# EAGLE design Rolllaeden (EAGLE 7.4.0)

## Sheet 1 of 3
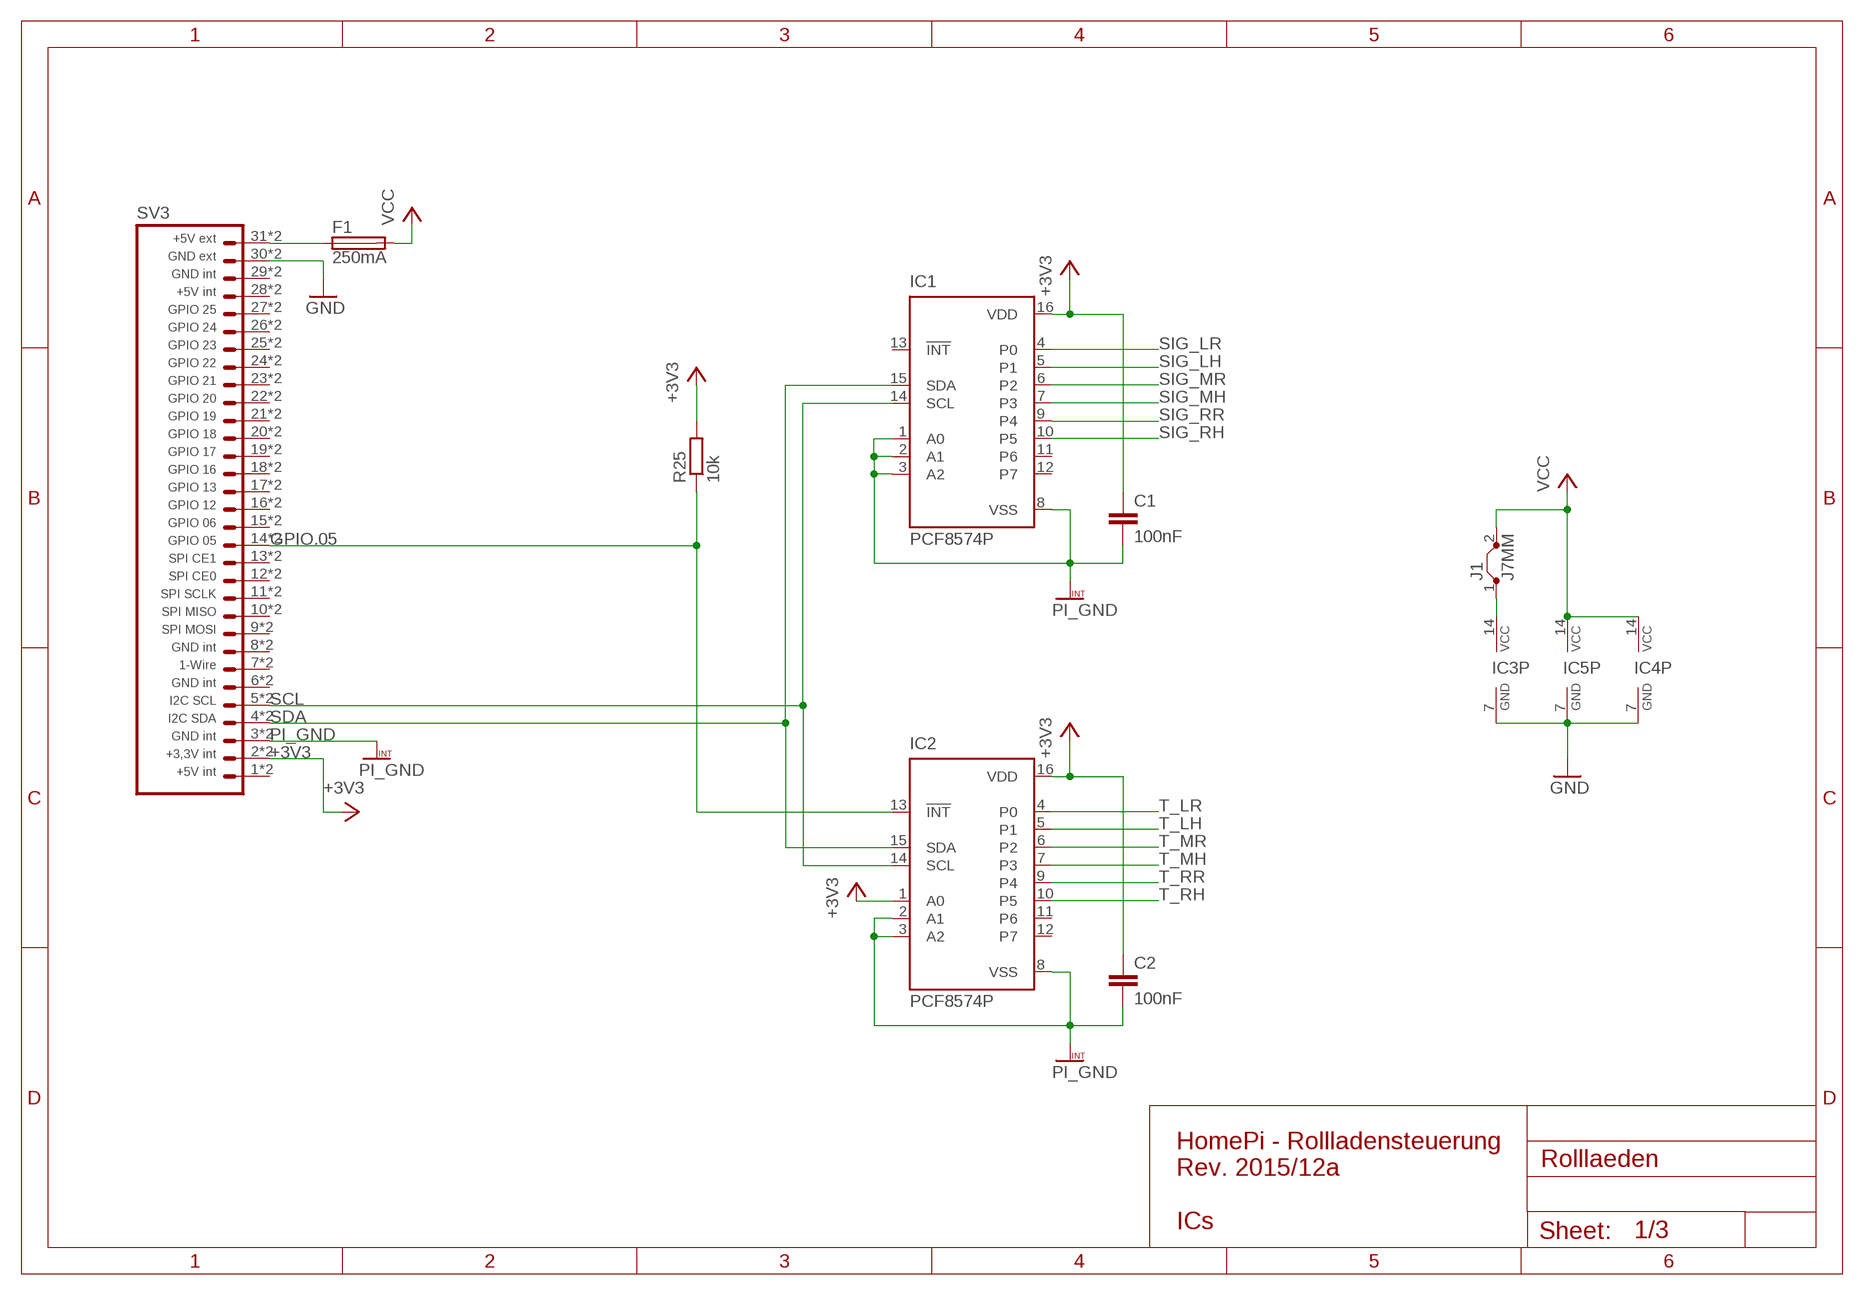
[diagram p0: schematic, sheet 1]

### Parts
C1  100nF  C-EU025-025X050  [C025-025X050]
C2  100nF  C-EU025-025X050  [C025-025X050]
F1  250mA  LITTLEFUSE  [LITTLEFUSE]
IC1  PCF8574P  [DIL16]
IC2  PCF8574P  [DIL16]
IC3  74HCT04N  [DIL14]
IC4  74HCT08N  [DIL14]
IC5  74HCT08N  [DIL14]
J1  J7MM  [07]
R25  10k  R-EU_0204/2V  [0204V]
SV3  PLATINENVERBINDER-31SMD  [PLATINENVERBINDER-31-SMD]

### Nets
+3V3: C1.1 C2.1 IC1.16(VDD) IC2.1(A0) IC2.16(VDD) R25.2 SV3.2 SV3.2T ; also sheet 2
GND [gnd]: IC3.7(P:GND) IC4.7(P:GND) IC5.7(P:GND) SV3.30 SV3.30T ; also sheet 2,3
GPIO.05: IC2.13(!INT) R25.1 SV3.14 SV3.14T
N$67: IC3.14(P:VCC) J1.1
N$68: F1.1 SV3.31 SV3.31T
PI_GND [gnd]: C1.2 C2.2 IC1.1(A0) IC1.2(A1) IC1.3(A2) IC1.8(VSS) IC2.2(A1) IC2.3(A2) IC2.8(VSS) SV3.3 SV3.3T ; also sheet 3
SCL: IC1.14(SCL) IC2.14(SCL) SV3.5 SV3.5T
SDA: IC1.15(SDA) IC2.15(SDA) SV3.4 SV3.4T
SIG_LH: IC1.5(P1) ; also sheet 2
SIG_LR: IC1.4(P0) ; also sheet 2
SIG_MH: IC1.7(P3) ; also sheet 2
SIG_MR: IC1.6(P2) ; also sheet 2
SIG_RH: IC1.10(P5) ; also sheet 2
SIG_RR: IC1.9(P4) ; also sheet 2
T_LH: IC2.5(P1) ; also sheet 3
T_LR: IC2.4(P0) ; also sheet 3
T_MH: IC2.7(P3) ; also sheet 3
T_MR: IC2.6(P2) ; also sheet 3
T_RH: IC2.10(P5) ; also sheet 3
T_RR: IC2.9(P4) ; also sheet 3
VCC: F1.2 IC4.14(P:VCC) IC5.14(P:VCC) J1.2 ; also sheet 2,3
Unconnected: IC1.11(P6) IC1.12(P7) IC1.13(!INT) IC2.11(P6) IC2.12(P7) IC4.1(A:I0) IC4.2(A:I1) IC4.3(A:O) IC4.4(B:I0) IC4.5(B:I1) IC4.6(B:O) SV3.1 SV3.1T SV3.6 SV3.6T SV3.7 SV3.7T SV3.8 SV3.8T SV3.9 SV3.9T SV3.10 SV3.10T SV3.11 SV3.11T SV3.12 SV3.12T SV3.13 SV3.13T SV3.15 SV3.15T SV3.16 SV3.16T SV3.17 SV3.17T SV3.18 SV3.18T SV3.19 SV3.19T SV3.20 SV3.20T SV3.21 SV3.21T SV3.22 SV3.22T SV3.23 SV3.23T SV3.24 SV3.24T SV3.25 SV3.25T SV3.26 SV3.26T SV3.27 SV3.27T SV3.28 SV3.28T SV3.29 SV3.29T

### Notes on the sheet
- HomePi - Rollladensteuerung
  Rev. 2015/12a
  
  ICs

## Sheet 2 of 3
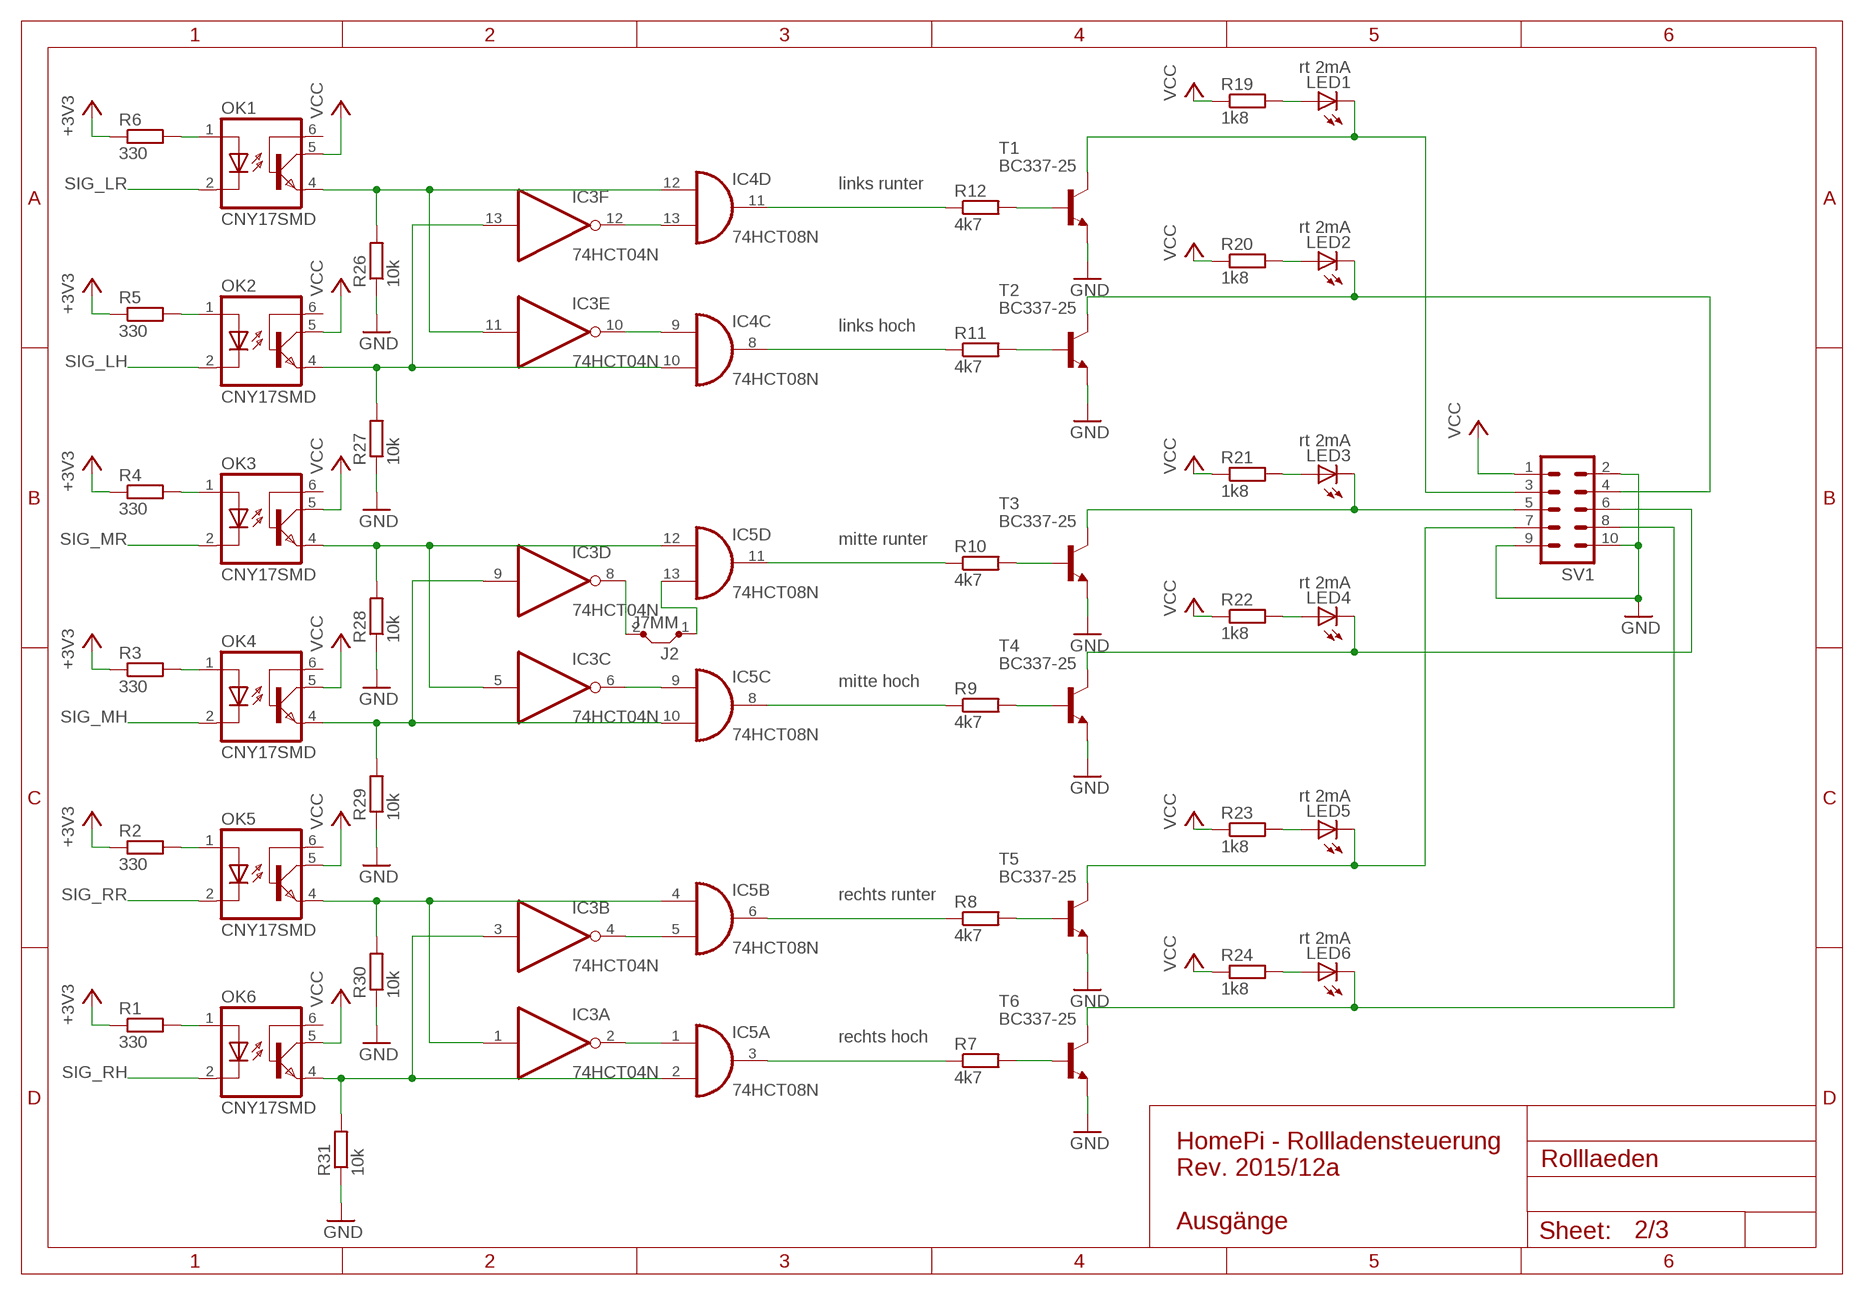
[diagram p1: schematic, sheet 2]

### Parts
J2  J7MM  [07]
LED1  rt 2mA  LED3MM  [LED3MM]
LED2  rt 2mA  LED3MM  [LED3MM]
LED3  rt 2mA  LED3MM  [LED3MM]
LED4  rt 2mA  LED3MM  [LED3MM]
LED5  rt 2mA  LED3MM  [LED3MM]
LED6  rt 2mA  LED3MM  [LED3MM]
OK1  CNY17SMD  [DIL06_SMD]
OK2  CNY17SMD  [DIL06_SMD]
OK3  CNY17SMD  [DIL06_SMD]
OK4  CNY17SMD  [DIL06_SMD]
OK5  CNY17SMD  [DIL06_SMD]
OK6  CNY17SMD  [DIL06_SMD]
R1  330  R-EU_0204/2V  [0204V]
R2  330  R-EU_0204/2V  [0204V]
R3  330  R-EU_0204/2V  [0204V]
R4  330  R-EU_0204/2V  [0204V]
R5  330  R-EU_0204/2V  [0204V]
R6  330  R-EU_0204/2V  [0204V]
R7  4k7  R-EU_0204/2V  [0204V]
R8  4k7  R-EU_0204/2V  [0204V]
R9  4k7  R-EU_0204/2V  [0204V]
R10  4k7  R-EU_0204/2V  [0204V]
R11  4k7  R-EU_0204/2V  [0204V]
R12  4k7  R-EU_0204/2V  [0204V]
R19  1k8  R-EU_0204/2V  [0204V]
R20  1k8  R-EU_0204/2V  [0204V]
R21  1k8  R-EU_0204/2V  [0204V]
R22  1k8  R-EU_0204/2V  [0204V]
R23  1k8  R-EU_0204/2V  [0204V]
R24  1k8  R-EU_0204/2V  [0204V]
R26  10k  R-EU_0204/2V  [0204V]
R27  10k  R-EU_0204/2V  [0204V]
R28  10k  R-EU_0204/2V  [0204V]
R29  10k  R-EU_0204/2V  [0204V]
R30  10k  R-EU_0204/2V  [0204V]
R31  10k  R-EU_0204/2V  [0204V]
SV1  ML10  [ML10]
T1  BC337-25  BC337-25-NPN-TO92-CBE  [TO92-CBE]
T2  BC337-25  BC337-25-NPN-TO92-CBE  [TO92-CBE]
T3  BC337-25  BC337-25-NPN-TO92-CBE  [TO92-CBE]
T4  BC337-25  BC337-25-NPN-TO92-CBE  [TO92-CBE]
T5  BC337-25  BC337-25-NPN-TO92-CBE  [TO92-CBE]
T6  BC337-25  BC337-25-NPN-TO92-CBE  [TO92-CBE]

### Nets
+3V3: R1.1 R2.1 R3.1 R4.1 R5.1 R6.1 ; also sheet 1
GND [gnd]: R26.1 R27.1 R28.1 R29.1 R30.1 R31.1 SV1.2 SV1.9 SV1.10 T1.E T2.E T3.E T4.E T5.E T6.E ; also sheet 1,3
N$1: OK5.1(A) R2.2
N$2: OK6.1(A) R1.2
N$3: R9.2 T4.B
N$4: IC3.3(B:I) IC5.2(A:I1) OK6.4(EMI) R31.2
N$6: IC5.3(A:O) R7.1
N$7: IC3.4(B:O) IC5.5(B:I1)
N$8: R10.2 T3.B
N$9: R8.2 T5.B
N$10: IC3.2(A:O) IC5.1(A:I0)
N$11: IC3.1(A:I) IC5.4(B:I0) OK5.4(EMI) R30.2
N$12: IC5.6(B:O) R8.1
N$13: OK2.1(A) R5.2
N$14: OK1.1(A) R6.2
N$15: LED1.A R19.2
N$17: OK4.1(A) R3.2
N$18: OK3.1(A) R4.2
N$22: IC3.9(D:I) IC5.10(C:I1) OK4.4(EMI) R29.2
N$23: IC3.5(C:I) IC5.12(D:I0) OK3.4(EMI) R28.2
N$24: IC3.8(D:O) J2.2
N$25: IC3.6(C:O) IC5.9(C:I0)
N$26: R7.2 T6.B
N$27: R11.2 T2.B
N$28: R12.2 T1.B
N$29: LED1.K(C) SV1.3 T1.C
N$30: IC5.8(C:O) R9.1
N$31: IC5.11(D:O) R10.1
N$34: IC3.13(F:I) IC4.10(C:I1) OK2.4(EMI) R27.2
N$35: IC3.11(E:I) IC4.12(D:I0) OK1.4(EMI) R26.2
N$38: IC3.12(F:O) IC4.13(D:I1)
N$39: IC3.10(E:O) IC4.9(C:I0)
N$40: LED2.K(C) SV1.4 T2.C
N$41: LED3.K(C) SV1.5 T3.C
N$42: LED4.K(C) SV1.6 T4.C
N$43: LED5.K(C) SV1.7 T5.C
N$44: IC4.8(C:O) R11.1
N$45: IC4.11(D:O) R12.1
N$46: LED6.K(C) SV1.8 T6.C
N$61: LED2.A R20.2
N$62: LED3.A R21.2
N$63: LED4.A R22.2
N$64: LED5.A R23.2
N$65: LED6.A R24.2
N$66: IC5.13(D:I1) J2.1
SIG_LH: OK2.2(C) ; also sheet 1
SIG_LR: OK1.2(C) ; also sheet 1
SIG_MH: OK4.2(C) ; also sheet 1
SIG_MR: OK3.2(C) ; also sheet 1
SIG_RH: OK6.2(C) ; also sheet 1
SIG_RR: OK5.2(C) ; also sheet 1
VCC: OK1.5(COL) OK2.5(COL) OK3.5(COL) OK4.5(COL) OK5.5(COL) OK6.5(COL) R19.1 R20.1 R21.1 R22.1 R23.1 R24.1 SV1.1 ; also sheet 1,3
Unconnected: OK1.6(BAS) OK2.6(BAS) OK3.6(BAS) OK4.6(BAS) OK5.6(BAS) OK6.6(BAS)

### Notes on the sheet
- links runter
- links hoch
- mitte runter
- mitte hoch
- rechts runter
- rechts hoch
- HomePi - Rollladensteuerung
  Rev. 2015/12a
  
  Ausgänge

## Sheet 3 of 3
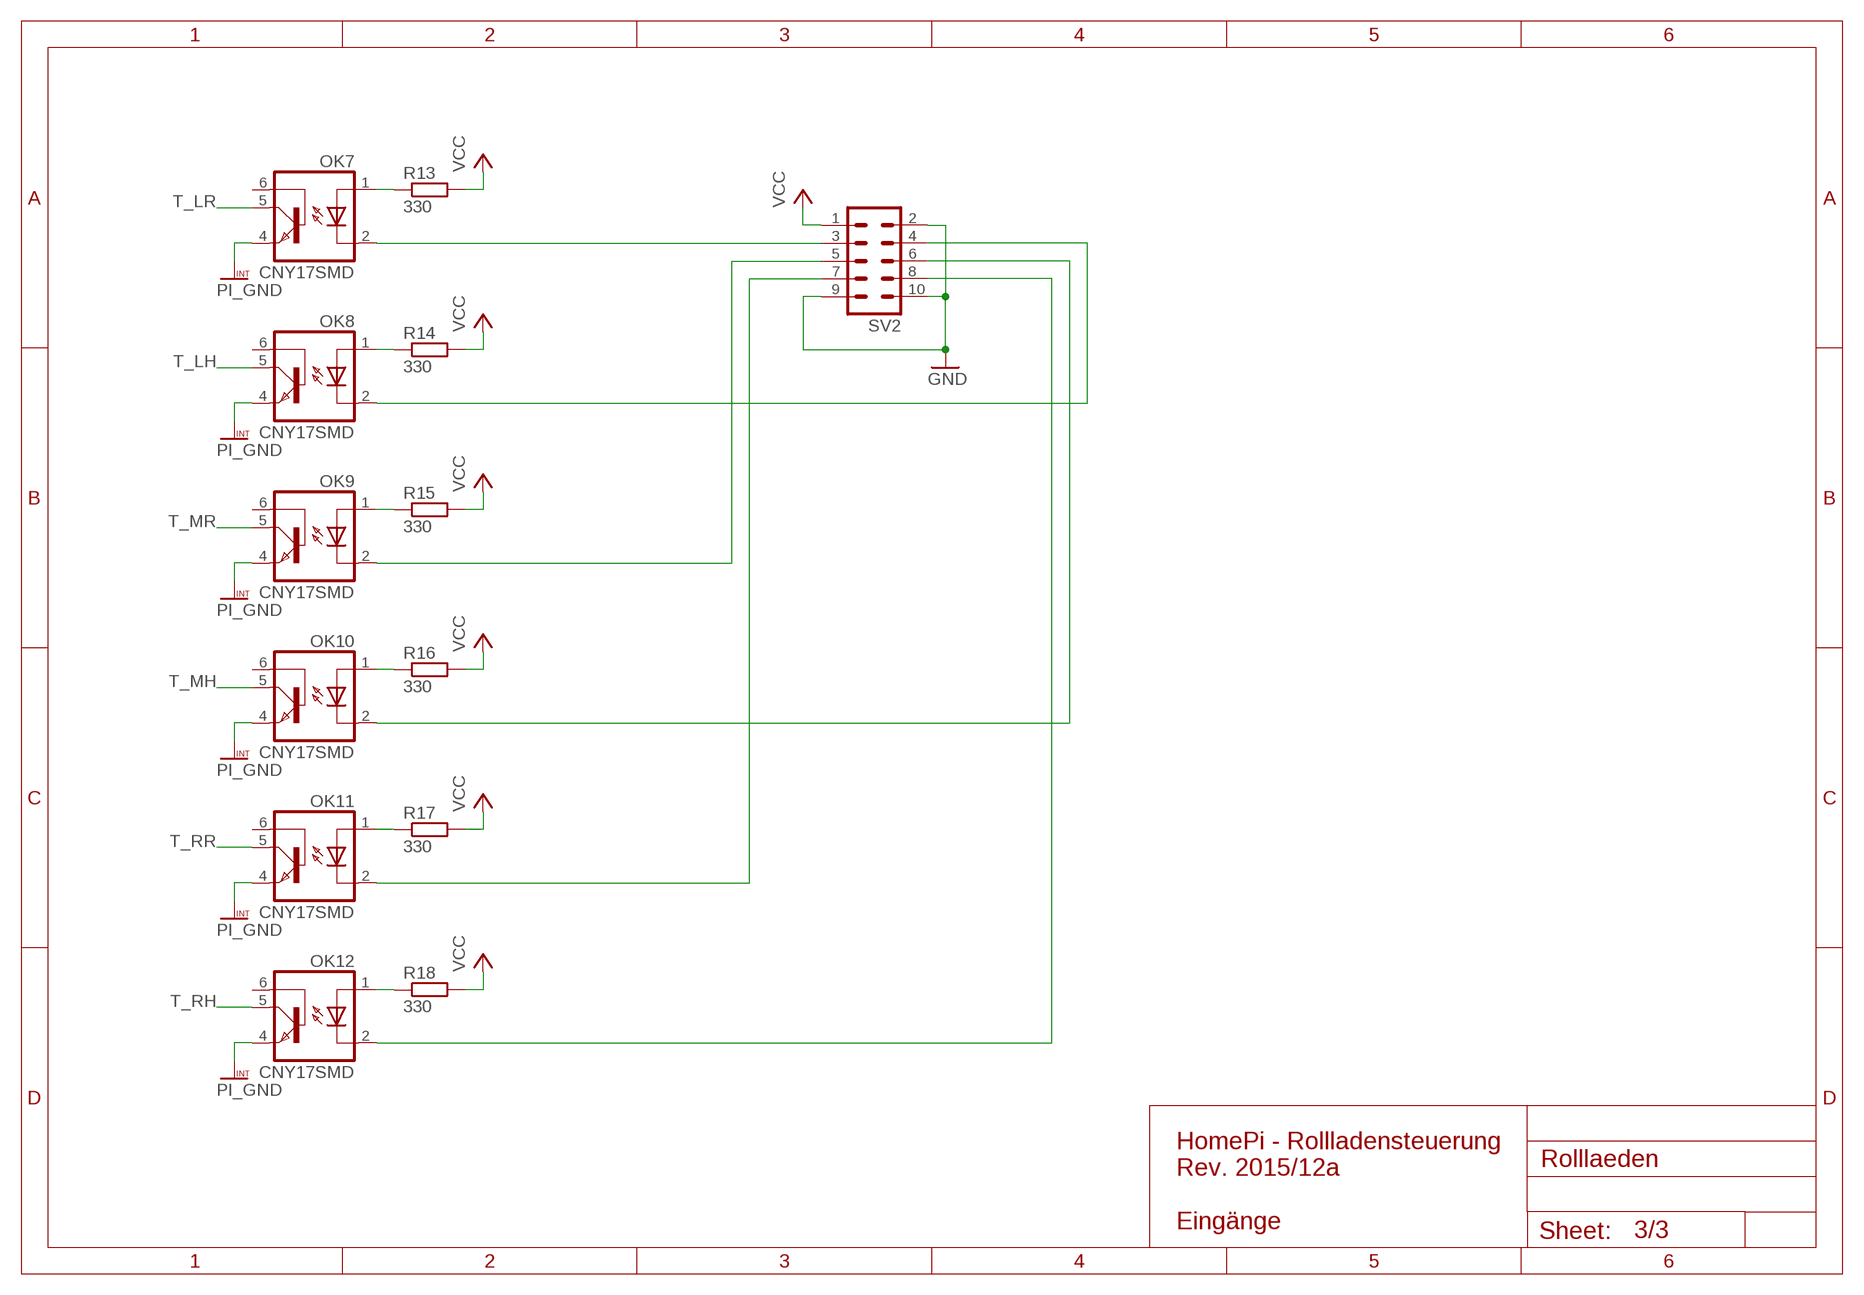
[diagram p2: schematic, sheet 3]

### Parts
OK7  CNY17SMD  [DIL06_SMD]
OK8  CNY17SMD  [DIL06_SMD]
OK9  CNY17SMD  [DIL06_SMD]
OK10  CNY17SMD  [DIL06_SMD]
OK11  CNY17SMD  [DIL06_SMD]
OK12  CNY17SMD  [DIL06_SMD]
R13  330  R-EU_0204/2V  [0204V]
R14  330  R-EU_0204/2V  [0204V]
R15  330  R-EU_0204/2V  [0204V]
R16  330  R-EU_0204/2V  [0204V]
R17  330  R-EU_0204/2V  [0204V]
R18  330  R-EU_0204/2V  [0204V]
SV2  ML10  [ML10]

### Nets
GND [gnd]: SV2.2 SV2.9 SV2.10 ; also sheet 1,2
N$5: OK8.2(C) SV2.4
N$19: OK7.1(A) R13.1
N$20: OK8.1(A) R14.1
N$21: OK7.2(C) SV2.3
N$49: OK9.2(C) SV2.5
N$52: OK9.1(A) R15.1
N$53: OK10.1(A) R16.1
N$54: OK10.2(C) SV2.6
N$55: OK11.2(C) SV2.7
N$58: OK11.1(A) R17.1
N$59: OK12.1(A) R18.1
N$60: OK12.2(C) SV2.8
PI_GND [gnd]: OK7.4(EMI) OK8.4(EMI) OK9.4(EMI) OK10.4(EMI) OK11.4(EMI) OK12.4(EMI) ; also sheet 1
T_LH: OK8.5(COL) ; also sheet 1
T_LR: OK7.5(COL) ; also sheet 1
T_MH: OK10.5(COL) ; also sheet 1
T_MR: OK9.5(COL) ; also sheet 1
T_RH: OK12.5(COL) ; also sheet 1
T_RR: OK11.5(COL) ; also sheet 1
VCC: R13.2 R14.2 R15.2 R16.2 R17.2 R18.2 SV2.1 ; also sheet 1,2
Unconnected: OK7.6(BAS) OK8.6(BAS) OK9.6(BAS) OK10.6(BAS) OK11.6(BAS) OK12.6(BAS)

### Notes on the sheet
- HomePi - Rollladensteuerung
  Rev. 2015/12a
  
  Eingänge

## Library data of the parts
C1 C2 = rcl:C-EU: CAPACITOR, European symbol
F1 = fuse:LITTLEFUSE: LITTLEFUSE Picofuse/slow Littlefuse; OC_FARNELL: unknown; OC_NEWARK: unknown
IC1 IC2 = micro-philips:PCF8574: I2C-Bus Remote 8-bit I/O expander http://www.semiconductors.philips.com/acrobat_download/datasheets/PCF8574_4.pdf; MPN: PCF8574PN; OC_FARNELL: 204020; OC_NEWARK: 11N8515
IC3 = 74xx-eu:74*04: Hex INVERTER
IC4 IC5 = 74xx-eu:74*08: Quad 2-input AND gate
J1 J2 = jumper:J: Bridge
LED1-LED6 = led:LED: LED OSRAM: - CHIPLED LG R971, LG N971, LY N971, LG Q971, LY Q971, LO R971, LY R971 LH N974, LH R974 LS Q976, LO Q976, LY Q976 LO Q996 - Hyper CHIPLED LW Q18S LB Q993, LB Q99A, LB R99A - SideLED LS A670, LO A670, LY A670, LG A670, LP A670 LB A673, LV A673, LT A673, LW A673 LH A674 LY A675 LS A676, LA A676, LO A676, LY A676, LW A676 LS A679, LY A679, LG A679 - Hyper Micro SIDELED® LS Y876, LA Y876, LO Y876, LY Y876 LT Y87S - SmartLED LW L88C, LW L88S LB L89C, LB L89S, LG L890 LS L89K, LO L89K, LY L89K LS L896, LA L896, LO L896, LY L896 - TOPLED LS T670, LO T670, LY T670, LG T670, LP T670 LSG T670, LSP T670, LSY T670, LOP T670, LYG T670 LG T671, LOG T671, LSG T671 LB T673, LV T673, LT T673, LW T673 LH T674 LS T676, LA T676, LO T676, LY T676, LB T676, LH T676, LSB T676, LW T676 LB T67C, LV T67C, LT T67C, LS T67K, LO T67K, LY T67K, LW E67C LS E67B, LA E67B, LO E67B, LY E67B, LB E67C, LV E67C, LT E67C LW T67C LS T679, LY T679, LG T679 LS T770, LO T770, LY T770, LG T770, LP T770 LB T773, LV T773, LT T773, LW T773 LH T774 LS E675, LA E675, LY E675, LS T675 LS T776, LA T776, LO T776, LY T776, LB T776 LHGB T686 LT T68C, LB T68C - Hyper Mini TOPLED® LB M676 - Mini TOPLED Santana® LG M470 LS M47K, LO M47K, LY M47K Source: http://www.osram.convergy.de LUXEON: - LUMILED® LXK2-PW12-R00, LXK2-PW12-S00, LXK2-PW14-U00, LXK2-PW14-V00 LXK2-PM12-R00, LXK2-PM12-S00, LXK2-PM14-U00 LXK2-PE12-Q00, LXK2-PE12-R00, LXK2-PE12-S00, LXK2-PE14-T00, LXK2-PE14-U00 LXK2-PB12-K00, LXK2-PB12-L00, LXK2-PB12-M00, LXK2-PB14-N00, LXK2-PB14-P00, LXK2-PB14-Q00 LXK2-PR12-L00, LXK2-PR12-M00, LXK2-PR14-Q00, LXK2-PR14-R00 LXK2-PD12-Q00, LXK2-PD12-R00, LXK2-PD12-S00 LXK2-PH12-R00, LXK2-PH12-S00 LXK2-PL12-P00, LXK2-PL12-Q00, LXK2-PL12-R00 Source: www.luxeon.com KINGBRIGHT: KA-3528ASYC Source: www.kingbright.com
OK1-OK12 = homepi:CNY17: SIEMENS OPTO COUPLER
R1-R31 = resistor:R-EU_: RESISTOR, European symbol
SV1 SV2 = con-harting-ml:ML10: HARTING; OC_FARNELL: unknown; OC_NEWARK: unknown
SV3 = homepi:PLATINENVERBINDER-31: 31-poliger Steckverbinder
T1-T6 = transistor:*-NPN-: NPN Transistror BF959 corrected 2008.03.06

## Net classes
0 default: width 0.406 mm
1 gnd: width 0.61 mm

## Board
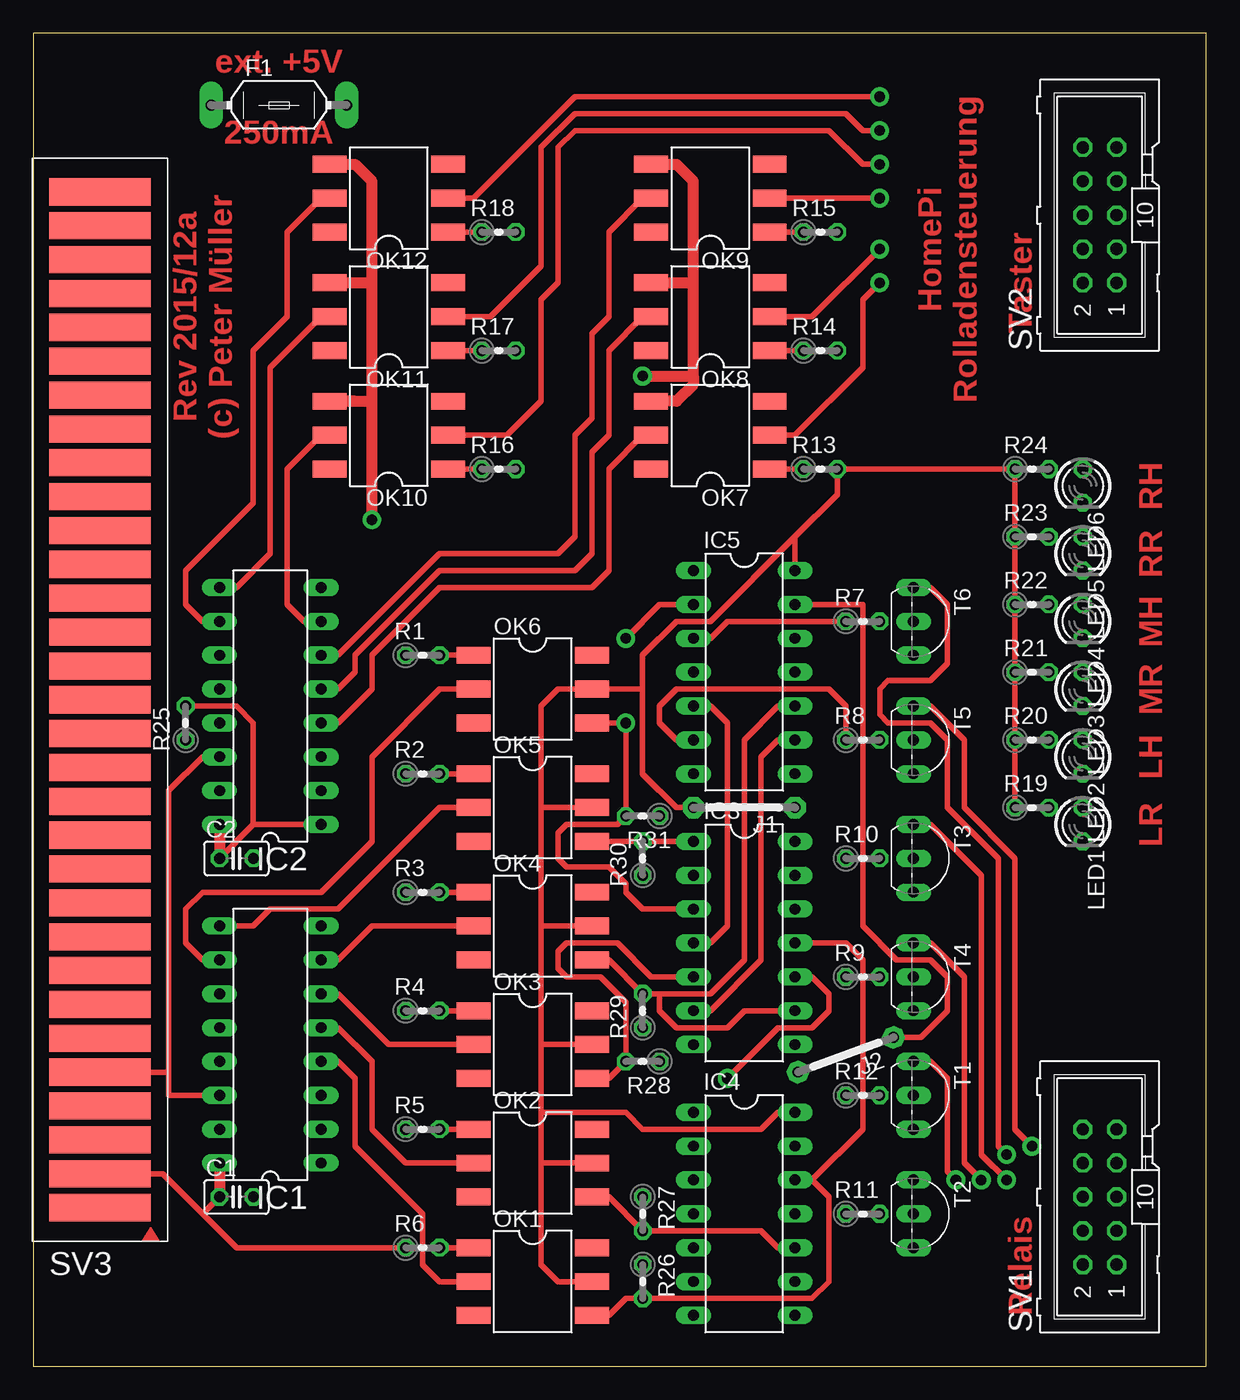
[diagram p3: board, top side]
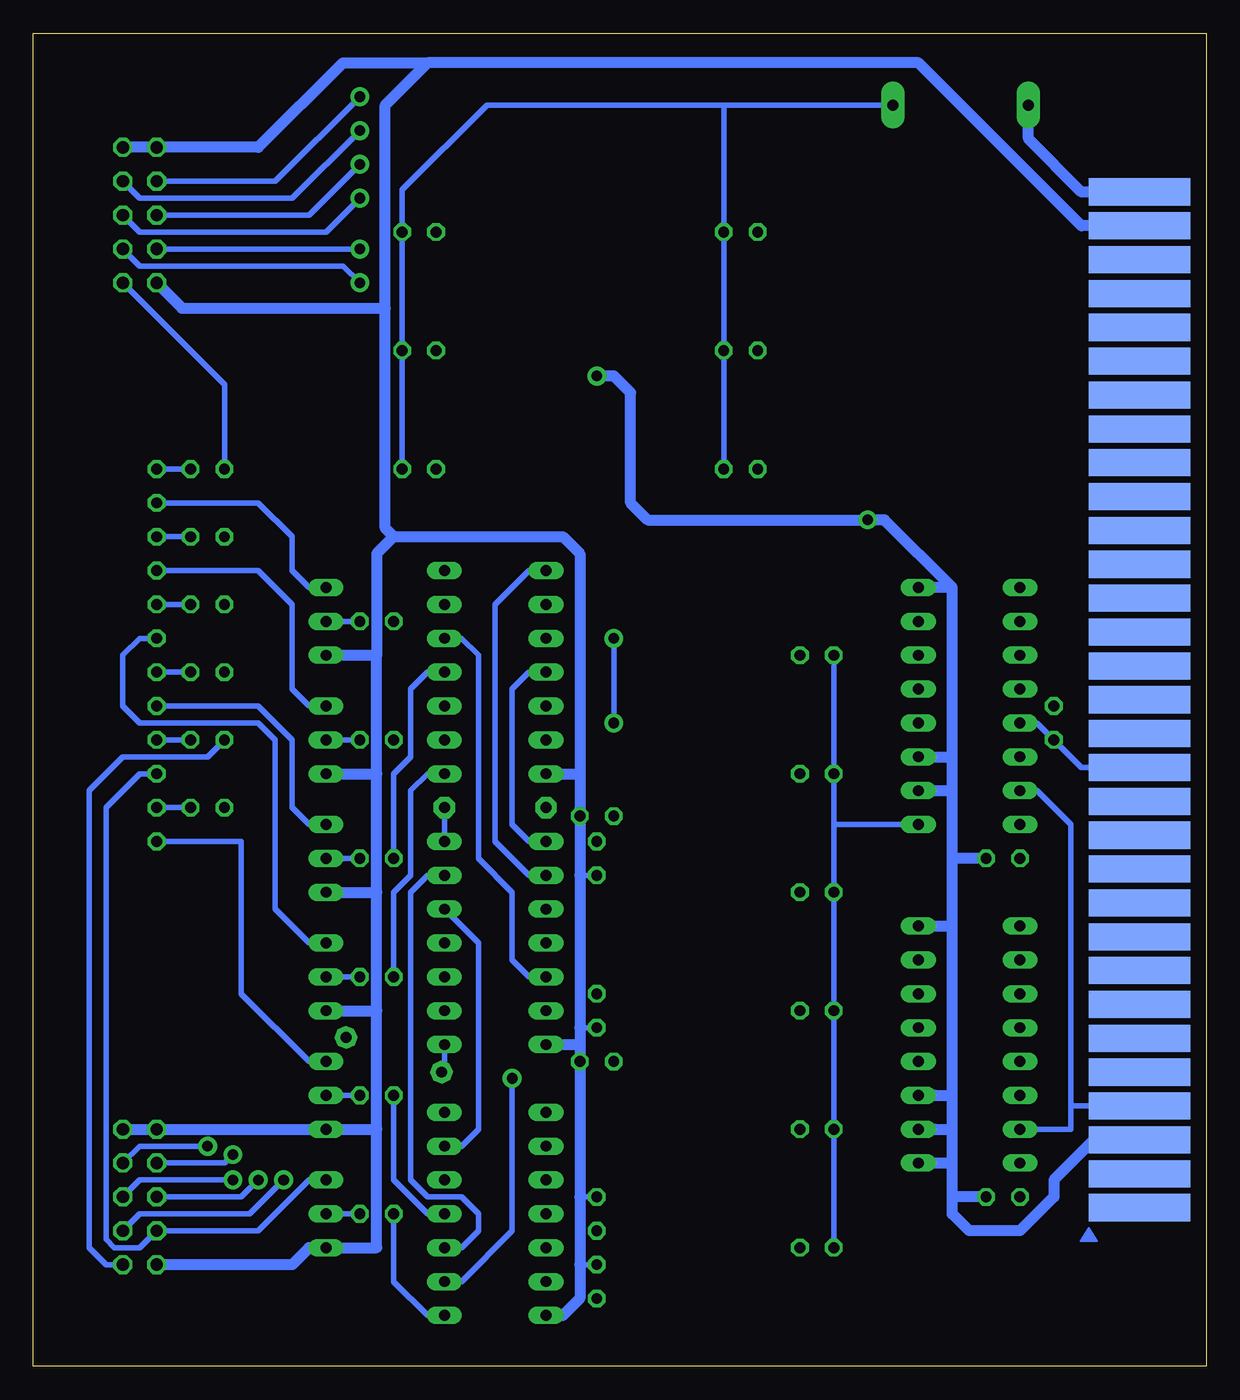
[diagram p4: board, bottom side, seen from below]

Size 88 x 100 mm. Coordinates in mm from the lower left corner, seen from the top.
Outline: 0,0 88,0 88,100 0,100 0,0
Copper layers (1*16): Top 0.035mm / dielectric 1.5mm / Bottom 0.035mm
Design rules "default *": minimum track width 10mil, minimum drill 24mil, track to track 0.2mm, track to pad 0.2mm, pad to pad 0.2mm, via to via 0.2mm, smd to smd 0.2mm, copper to edge 40mil, drill to drill 0.4mm, minimum pad ring 10mil, minimum via ring 8mil, stop-mask expansion 4mil, vias tented up to drill 0mil, thermal gap 10mil

### Footprints (pad centres in the part's own frame; a part is rotated, then mirrored left to right if it is on the bottom)
C025-025X050 = drill 0.813 octagon: 1 -1.27,0; 2 1.27,0
LITTLEFUSE = drill 0.813 pad 1.778 long: 1 -5.08,0; 2 5.08,0
DIL16 = drill 0.813 long: 1 -8.89,-3.81; 2 -6.35,-3.81; 3 -3.81,-3.81; 4 -1.27,-3.81; 5 1.27,-3.81; 6 3.81,-3.81; 7 6.35,-3.81; 8 8.89,-3.81; 9 8.89,3.81; 10 6.35,3.81; 11 3.81,3.81; 12 1.27,3.81; 13 -1.27,3.81; 14 -3.81,3.81; 15 -6.35,3.81; 16 -8.89,3.81
DIL14 = drill 0.813 long: 1 -7.62,-3.81; 2 -5.08,-3.81; 3 -2.54,-3.81; 4 0,-3.81; 5 2.54,-3.81; 6 5.08,-3.81; 7 7.62,-3.81; 8 7.62,3.81; 9 5.08,3.81; 10 2.54,3.81; 11 0,3.81; 12 -2.54,3.81; 13 -5.08,3.81; 14 -7.62,3.81
07 = drill 0.813 pad 1.6 octagon: 1 -3.81,0; 2 3.81,0
LED3MM = drill 0.813 octagon: A -1.27,0; K 1.27,0
DIL06_SMD = smd 1.27 x 2.54: 1 -2.54,-4.445; 2 0,-4.445; 3 2.54,-4.445; 4 2.54,4.445; 5 0,4.445; 6 -2.54,4.445
0204V = drill 0.813 octagon: 1 -1.27,0; 2 1.27,0
ML10 = drill 0.914 octagon: 1 -5.08,-1.27; 2 -5.08,1.27; 3 -2.54,-1.27; 4 -2.54,1.27; 5 0,-1.27; 6 0,1.27; 7 2.54,-1.27; 8 2.54,1.27; 9 5.08,-1.27; 10 5.08,1.27
PLATINENVERBINDER-31-SMD = smd 7.62 x 2.032 bottom: 1 0,-38.1; 2 0,-35.56; 3 0,-33.02; 4 0,-30.48; 5 0,-27.94; 6 0,-25.4; 7 0,-22.86; 8 0,-20.32; 9 0,-17.78; 10 0,-15.24; 11 0,-12.7; 12 0,-10.16; 13 0,-7.62; 14 0,-5.08; 15 0,-2.54; 16 0,0; 17 0,2.54; 18 0,5.08; 19 0,7.62; 20 0,10.16; 21 0,12.7; 22 0,15.24; 23 0,17.78; 24 0,20.32; 25 0,22.86; 26 0,25.4; 27 0,27.94; 28 0,30.48; 29 0,33.02; 30 0,35.56; 31 0,38.1 | smd 7.62 x 2.032: 1T 0,-38.1; 2T 0,-35.56; 3T 0,-33.02; 4T 0,-30.48; 5T 0,-27.94; 6T 0,-25.4; 7T 0,-22.86; 8T 0,-20.32; 9T 0,-17.78; 10T 0,-15.24; 11T 0,-12.7; 12T 0,-10.16; 13T 0,-7.62; 14T 0,-5.08; 15T 0,-2.54; 16T 0,0; 17T 0,2.54; 18T 0,5.08; 19T 0,7.62; 20T 0,10.16; 21T 0,12.7; 22T 0,15.24; 23T 0,17.78; 24T 0,20.32; 25T 0,22.86; 26T 0,25.4; 27T 0,27.94; 28T 0,30.48; 29T 0,33.02; 30T 0,35.56; 31T 0,38.1
TO92-CBE = drill 0.813 long: B 0,0; C -2.54,0; E 2.54,0

### Placement (x,y rotation side)
C1  15.24,12.7 0 top
C2  15.24,38.1 0 top
F1  18.41,94.61 0 top
IC1  17.78,24.13 90 top
IC2  17.78,49.53 90 top
IC3  53.34,31.75 270 top
IC4  53.34,11.43 270 top
IC5  53.34,52.07 270 top
J1  53.34,41.91 180 top
J2  60.96,23.37 200 top
LED1  78.74,40.64 270 top
LED2  78.74,45.72 270 top
LED3  78.74,50.8 270 top
LED4  78.74,55.88 270 top
LED5  78.74,60.96 270 top
LED6  78.74,66.04 270 top
OK1  37.47,6.35 270 top
OK2  37.47,15.24 270 top
OK3  37.47,24.13 270 top
OK4  37.47,33.02 270 top
OK5  37.47,41.91 270 top
OK6  37.47,50.8 270 top
OK7  50.8,69.85 90 top
OK8  50.8,78.74 90 top
OK9  50.8,87.63 90 top
OK10  26.67,69.85 90 top
OK11  26.67,78.74 90 top
OK12  26.67,87.63 90 top
R1  29.21,53.34 0 top
R2  29.21,44.45 0 top
R3  29.21,35.56 0 top
R4  29.21,26.67 0 top
R5  29.21,17.78 0 top
R6  29.21,8.89 0 top
R7  62.23,55.88 0 top
R8  62.23,46.99 0 top
R9  62.23,29.21 0 top
R10  62.23,38.1 0 top
R11  62.23,11.43 0 top
R12  62.23,20.32 0 top
R13  59.05,67.31 0 top
R14  59.05,76.2 0 top
R15  59.05,85.09 0 top
R16  34.92,67.31 0 top
R17  34.92,76.2 0 top
R18  34.92,85.09 0 top
R19  74.93,41.91 0 top
R20  74.93,46.99 0 top
R21  74.93,52.07 0 top
R22  74.93,57.15 0 top
R23  74.93,62.23 0 top
R24  74.93,67.31 0 top
R25  11.43,48.26 90 top
R26  45.72,6.35 270 top
R27  45.72,11.43 270 top
R28  45.72,22.86 180 top
R29  45.72,26.67 90 top
R30  45.72,38.1 90 top
R31  45.72,41.27 180 top
SV1  80.01,12.7 90 top
SV2  80.01,86.36 90 top
SV3  5,50 0 top
T1  66.04,20.32 270 top
T2  66.04,11.43 270 top
T3  66.04,38.1 270 top
T4  66.04,29.21 270 top
T5  66.04,46.99 270 top
T6  66.04,55.88 270 top

### Tracks (layer width: path | path; a pad name or v marks a point on that pad's centre or on a via)
+3V3
  Top 0.406: R6.1 15.24,8.89 12.7,11.43 | IC2.1 16.51,40.64 | 16.51,40.64 C2.1 | 12.7,11.43 9.69,14.44 SV3.2T | C1.1 12.7,11.43 | R25.2 15.24,49.53 16.51,48.26 16.51,40.64
  Top 0.813: IC2.16 C2.1 | IC1.16 C1.1
  Bottom 0.406: R6.1 R5.1 R4.1 R3.1 27.94,40.64 | 27.94,40.64 R2.1 R1.1 | IC2.1 27.94,40.64
GND
  Bottom 0.406: R30.1 46.99,36.83 | R29.1 46.99,25.4 | R27.1 46.99,12.7 | R26.1 46.99,7.62
  Bottom 0.813: T6.E 62.23,53.34 | T5.E 62.23,44.45 | 62.23,44.45 62.23,53.34 | T3.E 62.23,35.56 | 62.23,35.56 62.23,44.45 | T4.E 62.23,26.67 | 62.23,26.67 62.23,35.56 | 62.23,17.78 T1.E SV1.10 SV1.9 | 62.23,17.78 62.23,26.67 | 62.23,17.78 62.23,8.89 T2.E 67.31,8.89 68.58,7.62 SV1.2 | IC3.7 46.99,24.13 | 46.99,24.13 R28.1 46.99,12.7 46.99,7.62 46.99,5.08 48.26,3.81 IC4.7 | IC5.7 46.99,44.45 | 46.99,44.45 R31.1 46.99,36.83 46.99,25.4 46.99,24.13 | 58.42,97.79 21.59,97.79 9.36,85.56 SV3.30T | 60.96,62.23 62.23,60.96 62.23,53.34 | 60.96,62.23 48.26,62.23 46.99,60.96 46.99,44.45 | 60.96,62.23 61.59,62.87 61.59,79.38 | 61.59,79.38 61.59,94.61 58.42,97.79 | 61.59,79.38 76.83,79.38 SV2.2 | 58.42,97.79 64.77,97.79 71.12,91.44 SV2.10 SV2.9
GPIO.05
  Bottom 0.406: IC2.13 12.7,48.26 R25.1 9.36,44.92 SV3.14T
N$1
  Top 0.406: R2.2 OK5.1
N$2
  Top 0.406: R1.2 OK6.1
N$3
  Bottom 0.406: T4.B R9.2
N$4  (via drill 0.8 pad 1.42)
  Top 0.406: OK6.4 v44.45,48.26 R31.2 43.81,40.64 40.01,40.64 39.37,40.01 39.37,38.1 40.01,37.47 43.18,37.47 44.45,36.2 44.45,35.56 45.72,34.29 IC3.3 | v44.45,54.61 46.99,57.15 IC5.2
  Bottom 0.406: v44.45,54.61 v44.45,48.26
N$5  (via drill 0.8 pad 1.42)
  Top 0.406: v63.5,83.82 58.42,78.74 OK8.2
  Bottom 0.406: v63.5,83.82 SV2.4
N$6
  Top 0.406: IC5.3 50.8,54.61 52.07,55.88 R7.1
N$7
  Top 0.406: IC3.4 50.8,31.75 52.07,33.02 52.07,48.26 50.8,49.53 IC5.5
N$8
  Bottom 0.406: T3.B R10.2
N$9
  Bottom 0.406: T5.B R8.2
N$10
  Bottom 0.406: IC3.2 50.8,36.83 53.34,39.37 53.34,57.15 50.8,59.69 IC5.1
N$11
  Top 0.406: IC3.1 R30.2 OK5.4
  Bottom 0.406: IC3.1 50.8,39.37 52.07,40.64 52.07,50.8 50.8,52.07 IC5.4
N$12
  Top 0.406: R8.1 60.96,49.53 59.69,50.8 48.26,50.8 46.99,49.53 46.99,48.26 48.26,46.99 IC5.6
N$13
  Top 0.406: OK2.1 R5.2
N$14
  Top 0.406: R6.2 OK1.1
N$15
  Bottom 0.406: R19.2 LED1.A
N$17
  Top 0.406: OK4.1 R3.2
N$18
  Top 0.406: R4.2 OK3.1
N$19
  Top 0.406: R13.1 OK7.1
N$20
  Top 0.406: OK8.1 R14.1
N$21  (via drill 0.8 pad 1.42)
  Top 0.406: OK7.2 57.15,69.85 62.23,74.93 62.23,80.01 v63.5,81.28
  Bottom 0.406: SV2.3 80.01,82.55 64.77,82.55 v63.5,81.28
N$22
  Top 0.406: IC3.9 53.34,26.67 52.07,25.4 48.26,25.4 46.99,26.67 46.99,27.94 | IC5.10 55.88,49.53 53.34,46.99 53.34,30.48 50.8,27.94 46.99,27.94 | 46.99,27.94 R29.2 43.18,30.48 OK4.4
N$23
  Top 0.406: IC3.5 46.35,29.21 43.81,31.75 40.01,31.75 39.37,31.11 39.37,29.84 40.01,29.21 42.55,29.21 44.45,27.3 R28.2 43.18,21.59 OK3.4
  Bottom 0.406: IC3.5 50.8,29.21 52.07,30.48 52.07,35.56 54.61,38.1 54.61,53.34 55.88,54.61 IC5.12
N$24
  Bottom 0.406: IC3.8 57.15,22.3 J2.2
N$25
  Top 0.406: IC3.6 50.8,26.67 54.61,30.48 54.61,45.72 55.88,46.99 IC5.9
N$26
  Bottom 0.406: T6.B R7.2
N$27
  Bottom 0.406: T2.B R11.2
N$28
  Bottom 0.406: T1.B R12.2
N$29  (via drill 0.8 pad 1.42)
  Top 0.406: T1.C 67.31,22.86 68.58,21.59 68.58,14.61 v69.22,13.97
  Bottom 0.406: T1.C 67.31,22.86 72.39,27.94 72.39,39.37 LED1.K | v69.22,13.97 71.75,11.43 80.01,11.43 SV1.3
N$30
  Bottom 0.406: R9.1 60.96,35.56 59.69,36.83 59.69,43.18 58.42,44.45 IC5.8
N$31
  Bottom 0.406: R10.1 60.96,44.45 59.69,45.72 59.69,50.8 58.42,52.07 IC5.11
N$34
  Top 0.406: OK2.4 43.18,12.7 R27.2 54.61,10.16 55.88,8.89 IC4.10
  Bottom 0.406: IC3.13 58.42,36.83 59.69,35.56 59.69,13.97 58.42,12.7 55.88,12.7 54.61,11.43 54.61,10.16 55.88,8.89 IC4.10
N$35
  Top 0.406: 58.42,13.97 62.23,17.78 62.23,30.48 60.96,31.75 IC3.11 | IC4.12 58.42,13.97 | 58.42,13.97 59.69,12.7 59.69,6.35 58.42,5.08 R26.2 44.45,5.08 43.18,3.81 OK1.4
N$38
  Bottom 0.406: IC3.12 54.61,31.75 54.61,17.78 55.88,16.51 IC4.13
N$39  (via drill 0.8 pad 1.42)
  Top 0.406: v52.07,21.59 55.88,25.4 58.42,25.4 59.69,26.67 59.69,27.94 58.42,29.21 IC3.10
  Bottom 0.406: v52.07,21.59 52.07,10.16 55.88,6.35 IC4.9
N$40
  Bottom 0.406: T2.C 67.31,13.97 71.12,10.16 SV1.4 80.01,8.89 81.92,8.89 82.55,9.53 82.55,41.91 80.01,44.45 LED2.K
N$41  (via drill 0.8 pad 1.42)
  Top 0.406: T3.C 67.31,40.64 71.12,36.83 71.12,15.88 v73.03,13.97
  Bottom 0.406: T3.C 67.31,40.64 68.58,41.91 68.58,46.99 71.12,49.53 LED3.K | v73.03,13.97 80.01,13.97 SV1.5
N$42  (via drill 0.8 pad 1.42)
  Top 0.406: T4.C 67.31,31.75 69.85,29.21 69.85,15.24 v71.12,13.97
  Bottom 0.406: T4.C 67.31,31.75 69.85,34.29 69.85,46.99 71.12,48.26 80.01,48.26 81.28,49.53 81.28,53.34 80.01,54.61 LED4.K | v71.12,13.97 72.39,12.7 SV1.6
N$43  (via drill 0.8 pad 1.42)
  Top 0.406: T5.C 67.31,49.53 69.85,46.99 69.85,41.91 73.66,38.1 73.66,17.78 v74.93,16.51
  Bottom 0.406: T5.C 67.31,49.53 68.58,50.8 68.58,57.15 71.12,59.69 LED5.K | v74.93,16.51 80.01,16.51 SV1.7
N$44
  Bottom 0.406: IC4.8 58.42,3.81 60.96,6.35 R11.1
N$45
  Bottom 0.406: IC4.11 58.42,11.43 60.96,13.97 R12.1
N$46  (via drill 0.8 pad 1.42)
  Top 0.406: T6.C 67.31,58.42 68.58,57.15 68.58,52.7 67.31,51.44 64.14,51.44 63.5,50.8 63.5,48.9 64.14,48.26 67.31,48.26 68.58,46.99 68.58,41.91 72.39,38.1 72.39,16.51 v73.03,15.88
  Bottom 0.406: T6.C 67.31,58.42 68.58,59.69 68.58,62.23 71.12,64.77 LED6.K | SV1.8 73.66,15.24 v73.03,15.88
N$49  (via drill 0.8 pad 1.42)
  Top 0.406: OK9.2 v63.5,87.63
  Bottom 0.406: SV2.5 80.01,85.09 66.04,85.09 v63.5,87.63
N$52
  Top 0.406: R15.1 OK9.1
N$53
  Top 0.406: OK10.1 R16.1
N$54  (via drill 0.8 pad 1.42)
  Top 0.406: OK10.2 35.56,69.85 38.1,72.39 38.1,80.01 39.37,81.28 39.37,91.44 40.64,92.71 59.69,92.71 62.23,90.17 v63.5,90.17
  Bottom 0.406: v63.5,90.17 67.31,86.36 SV2.6
N$55  (via drill 0.8 pad 1.42)
  Top 0.406: OK11.2 34.29,78.74 38.1,82.55 38.1,91.44 40.64,93.98 60.96,93.98 62.23,92.71 v63.5,92.71
  Bottom 0.406: SV2.7 80.01,87.63 68.58,87.63 v63.5,92.71
N$58
  Top 0.406: R17.1 OK11.1
N$59
  Top 0.406: OK12.1 R18.1
N$60  (via drill 0.8 pad 1.42)
  Top 0.406: OK12.2 33.02,87.63 40.64,95.25 v63.5,95.25
  Bottom 0.406: v63.5,95.25 69.85,88.9 SV2.8
N$61
  Bottom 0.406: LED2.A R20.2
N$62
  Bottom 0.406: R21.2 LED3.A
N$63
  Bottom 0.406: R22.2 LED4.A
N$64
  Bottom 0.406: R23.2 LED5.A
N$65
  Bottom 0.406: R24.2 LED6.A
N$66
  Top 0.406: J2.1 66.58,24.67 68.58,26.67 68.58,29.21 67.31,30.48 64.77,30.48 62.23,33.02 62.23,57.15 IC5.13
N$67
  Bottom 0.406: IC3.14 J1.1
N$68
  Bottom 0.813: SV3.31T 9.36,88.1 13.34,92.08 F1.1
PI_GND  (via drill 0.8 pad 1.42)
  Top 0.813: OK9.4 48.26,90.17 49.53,88.9 49.53,81.28 | OK12.4 24.13,90.17 25.4,88.9 25.4,81.28 | 24.13,72.39 OK10.4 25.4,72.39 | 49.53,74.3 49.53,81.28 | v25.4,63.5 25.4,72.39 | 25.4,72.39 25.4,81.28 | OK8.4 49.53,81.28 | OK11.4 25.4,81.28 | v45.72,74.3 49.53,74.3 | 49.53,74.3 49.53,73.66 48.26,72.39 OK7.4
  Bottom 0.813: 19.05,12.7 19.05,15.24 | 19.05,15.24 19.05,17.78 | 19.05,17.78 19.05,20.32 | 19.05,20.32 19.05,33.02 | 19.05,33.02 19.05,38.1 | 19.05,38.1 19.05,43.18 | 19.05,43.18 19.05,45.72 | 19.05,45.72 19.05,58.42 | 20.32,15.24 IC1.1 19.05,15.24 | 20.32,17.78 IC1.2 19.05,17.78 | 20.32,20.32 IC1.3 19.05,20.32 | 20.32,43.18 IC2.2 19.05,43.18 | C2.2 19.05,38.1 | 19.05,12.7 19.05,11.43 17.78,10.16 13.97,10.16 11.43,12.7 11.43,13.97 8.42,16.98 SV3.3T | C1.2 19.05,12.7 | 19.05,58.42 24.13,63.5 v25.4,63.5 41.91,63.5 43.18,64.77 43.18,73.03 44.45,74.3 v45.72,74.3 | IC2.3 19.05,45.72 | IC1.8 19.05,33.02 | 19.05,58.42 IC2.8
SCL
  Top 0.406: IC1.14 10.16,20.32 10.16,22.23 | 10.16,22.23 10.16,43.18 12.7,45.72 IC2.14 | SV3.5T 9.99,22.06 10.16,22.23
SDA
  Bottom 0.406: IC1.15 10.16,17.78 10.16,19.68 | 10.16,19.68 10.16,40.64 12.7,43.18 IC2.15 | SV3.4T 9.99,19.52 10.16,19.68
SIG_LH
  Top 0.406: IC1.5 22.86,25.4 25.4,22.86 25.4,17.78 27.94,15.24 OK2.2
SIG_LR
  Top 0.406: IC1.4 22.86,22.86 24.13,21.59 24.13,16.51 29.21,11.43 29.21,7.62 30.48,6.35 OK1.2
SIG_MH
  Top 0.406: OK4.2 25.4,33.02 22.86,30.48 IC1.7
SIG_MR
  Top 0.406: OK3.2 26.67,24.13 22.86,27.94 IC1.6
SIG_RH
  Top 0.406: OK6.2 30.48,50.8 25.4,45.72 25.4,39.37 21.59,35.56 12.7,35.56 11.43,34.29 11.43,31.75 12.7,30.48 IC1.10
SIG_RR
  Top 0.406: OK5.2 30.48,41.91 22.86,34.29 17.78,34.29 16.51,33.02 IC1.9
T_LH
  Top 0.406: OK8.5 45.72,78.74 43.18,76.2 43.18,69.85 41.91,68.58 41.91,60.96 40.64,59.69 30.48,59.69 24.13,53.34 24.13,52.07 22.86,50.8 IC2.5
T_LR
  Top 0.406: IC2.4 22.86,48.26 25.4,50.8 25.4,53.34 30.48,58.42 41.91,58.42 43.18,59.69 43.18,67.31 45.72,69.85 OK7.5
T_MH
  Top 0.406: OK10.5 21.59,69.85 19.05,67.31 19.05,57.15 20.32,55.88 IC2.7
T_MR
  Top 0.406: OK9.5 45.72,87.63 43.18,85.09 43.18,78.74 41.91,77.47 41.91,71.12 40.64,69.85 40.64,62.23 39.37,60.96 30.48,60.96 22.86,53.34 IC2.6
T_RH
  Top 0.406: OK12.5 21.59,87.63 19.05,85.09 19.05,78.74 16.51,76.2 16.51,64.77 11.43,59.69 11.43,57.15 12.7,55.88 IC2.10
T_RR
  Top 0.406: OK11.5 21.59,78.74 17.78,74.93 17.78,60.96 15.24,58.42 IC2.9
VCC
  Top 0.406: R19.1 R20.1 R21.1 R22.1 R23.1 R24.1 R13.2 60.33,65.41 57.15,62.23 | 45.72,50.8 OK6.5 39.37,50.8 38.1,49.53 38.1,41.91 | 38.1,41.91 38.1,33.02 | 38.1,33.02 38.1,24.13 | 38.1,24.13 38.1,19.05 | 38.1,19.05 38.1,15.24 | 38.1,15.24 38.1,7.62 39.37,6.35 OK1.5 | 39.37,33.02 OK4.5 38.1,33.02 | 39.37,41.91 OK5.5 38.1,41.91 | J1.2 48.26,41.91 45.72,44.45 45.72,50.8 | IC4.14 55.88,19.05 54.61,17.78 45.72,17.78 44.45,19.05 38.1,19.05 | OK2.5 38.1,15.24 | OK3.5 38.1,24.13 | 45.72,50.8 45.72,53.34 48.26,55.88 50.8,55.88 57.15,62.23 | IC5.14 57.15,62.23
  Bottom 0.406: R13.2 R14.2 R15.2 60.33,88.27 53.98,94.61 36.2,94.61 | R16.2 R17.2 R18.2 36.2,94.61 | SV2.1 73.66,73.66 R24.1 | SV1.1 82.55,7.62 83.82,8.89 83.82,43.18 81.28,45.72 74.93,45.72 R20.1 | F1.2 36.2,94.61

### Text on the board
Top: ext. +5V / / 250mA | HomePi / Rolladensteuerung | Rev 2015/12a / (c) Peter Müller | Taster | RH | RR | MH | MR | LH | LR | Relais